# Altium schematic sheet Connector_2.SchDoc
size A2; Date: Date; CompanyName: HESSO; Engineer: Name; Address1: Route du Rawyl 47; Address2: 1950 Sion; Address3: Switzerland; DocumentNumber: 2; SheetNumber: 2; SheetTotal: 3; ProjectName: Project Name

## Notes on the sheet
- Date :
- Revision :
- Sheet
- of
- Design by :